# EasyEDA Pro project MSDRV5.eprj

# Schematic Schematic2
Create Date: 2024-12-22; Page Name: P1; Project Name: MSDRV5; Schematic Name: Schematic2; Update Date: 2024-12-21; Company: EasyEDA.com; Page Size: A4; Version: V1.0
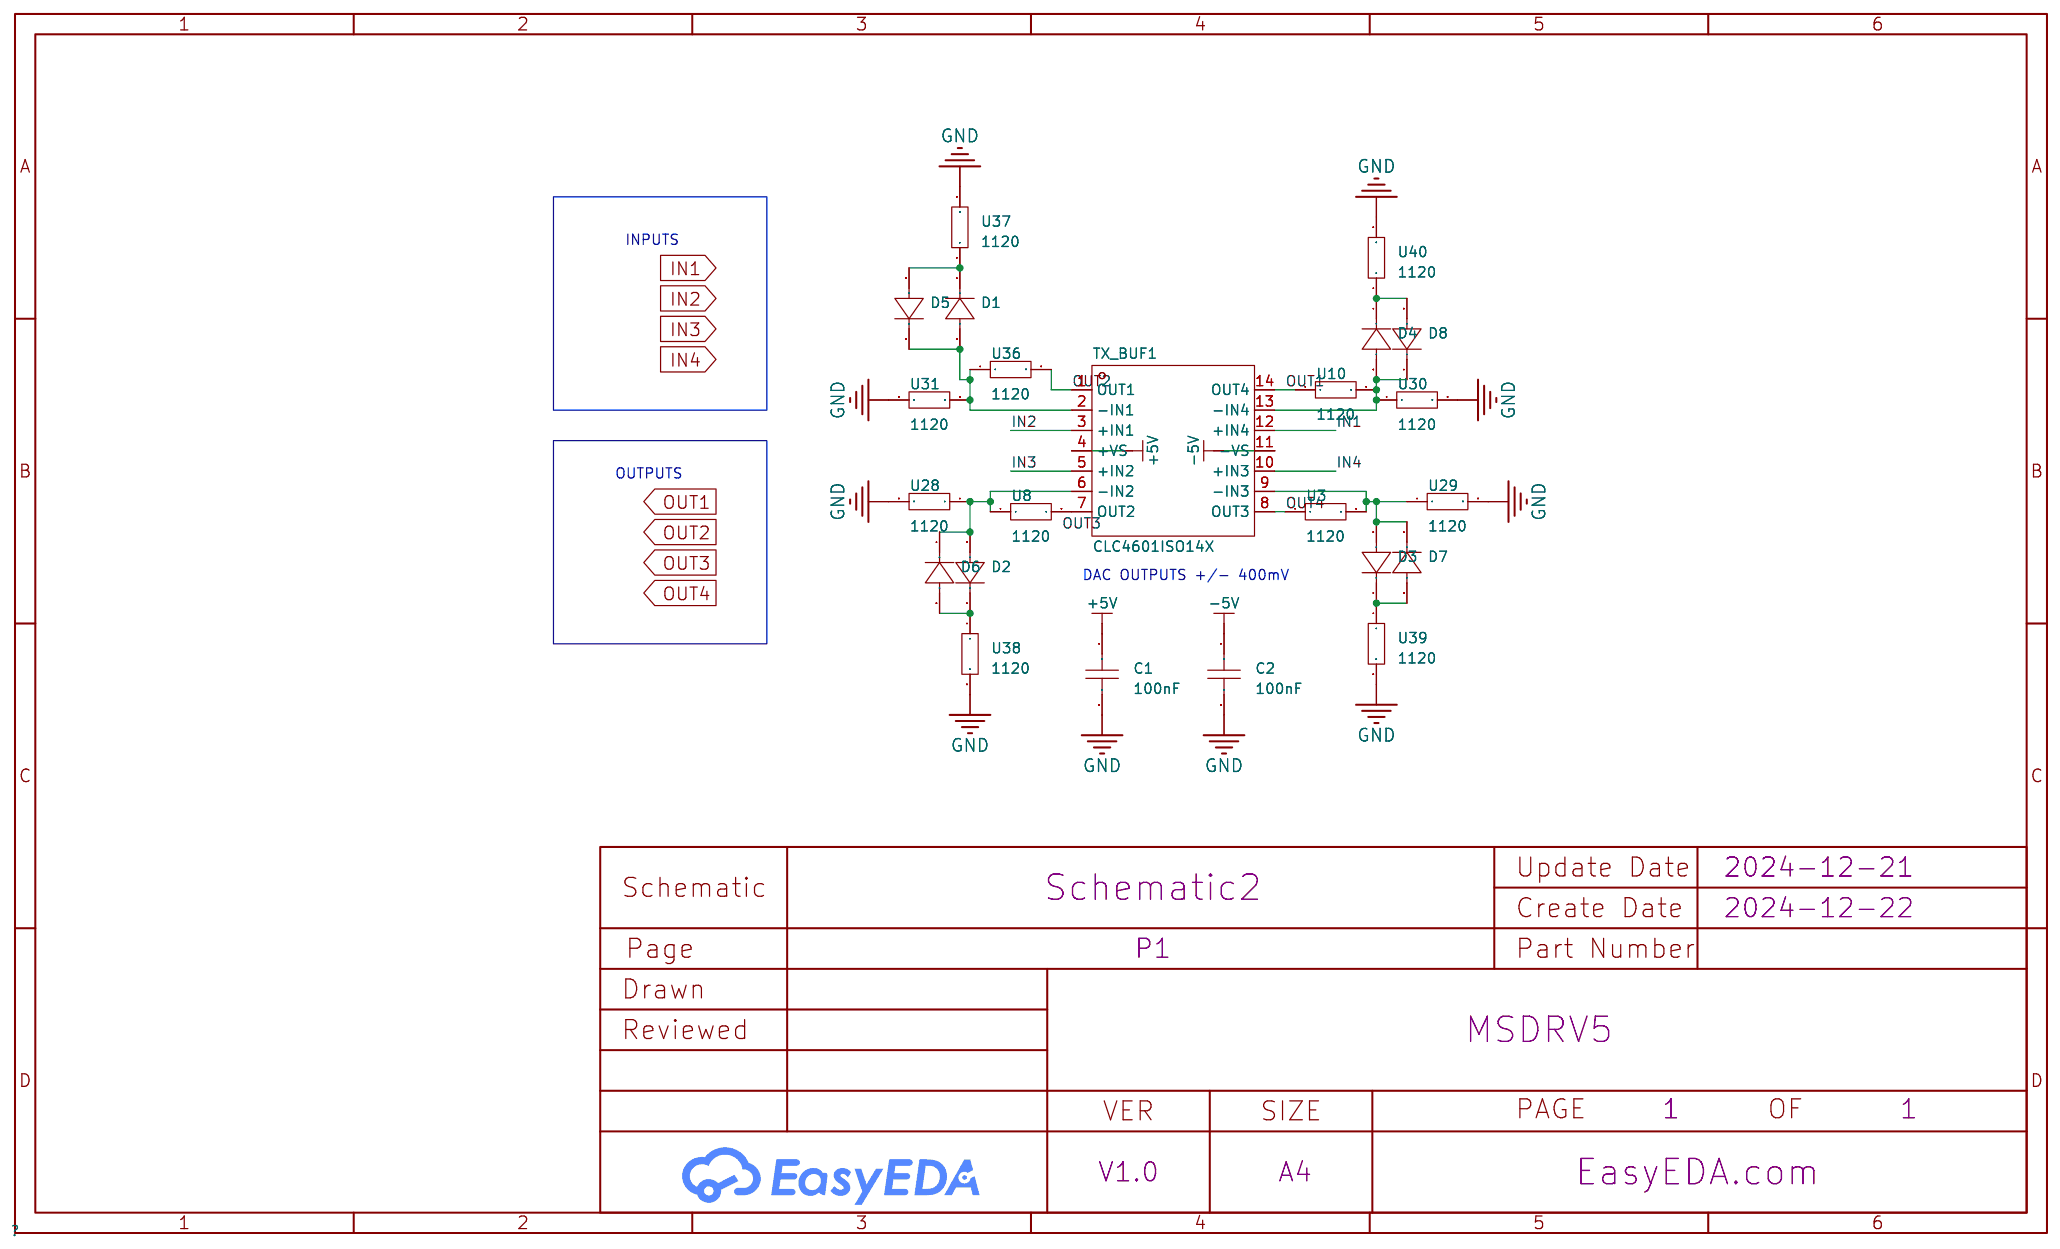
[diagram p0: schematic sheet]

## Parts
C1  100nF  [C0805]
C2  100nF  [C0805]
D1  -  [SMA_L4.4-W2.8-LS5.4-RD]
D2  -  [SMA_L4.4-W2.8-LS5.4-RD]
D3  -  [SMA_L4.4-W2.8-LS5.4-RD]
D4  -  [SMA_L4.4-W2.8-LS5.4-RD]
D5  -  [SMA_L4.4-W2.8-LS5.4-RD]
D6  -  [SMA_L4.4-W2.8-LS5.4-RD]
D7  -  [SMA_L4.4-W2.8-LS5.4-RD]
D8  -  [SMA_L4.4-W2.8-LS5.4-RD]
TX_BUF1  CLC4601ISO14X  [SOIC-14_L8.7-W3.9-P1.27-LS6.0-BL]
U3  1120  [R0805]
U8  1120  [R0805]
U10  1120  [R0805]
U28  1120  [R0805]
U29  1120  [R0805]
U30  1120  [R0805]
U31  1120  [R0805]
U36  1120  [R0805]
U37  1120  [R0805]
U38  1120  [R0805]
U39  1120  [R0805]
U40  1120  [R0805]

## Library data of the parts
C1 C2 = CAP_0805: Supplier Footprint: 0805
D1-D8 = 1N4007: Supplier Footprint: SMA(DO-214AC); Supplier Part: C727081
TX_BUF1 = CLC4601ISO14X: Number of Circuits:; Supplier Part: C49944; Supplier Footprint: SOIC-14; JLCPCB Part Class: Extended Part; Supplier: LCSC
U3 U8 U10 U28-U31 U36-U40 = 3R00: Supplier Part: C9900008006; JLCPCB Part Class: Extended Part; Supplier: LCSC

## Nets
+5V: C1.1 TX_BUF1.4(+VS)
-5V: C2.1 TX_BUF1.11(-VS)
GND: C1.2 C2.2 U28.2 U29.2 U30.2 U31.1 U37.2 U38.2 U39.2 U40.2
IN1: TX_BUF1.12(+IN4)
IN2: TX_BUF1.3(+IN1)
IN3: TX_BUF1.5(+IN2)
IN4: TX_BUF1.10(+IN3)
OUT1: TX_BUF1.14(OUT4) U10.1
OUT2: TX_BUF1.1(OUT1) U36.2
OUT3: TX_BUF1.7(OUT2) U8.2
OUT4: TX_BUF1.8(OUT3) U3.1
$1N800: D1.1(K) D5.2(A) U37.1
$1N805: D1.2(A) D5.1(K) TX_BUF1.2(-IN1) U31.2 U36.1
$1N838: D2.2(A) D6.1(K) TX_BUF1.6(-IN2) U8.1 U28.1
$1N849: D2.1(K) D6.2(A) U38.1
$1N878: D3.1(K) D7.2(A) U39.1
$1N883: D3.2(A) D7.1(K) TX_BUF1.9(-IN3) U3.2 U29.1
$1N916: D4.2(A) D8.1(K) TX_BUF1.13(-IN4) U10.2 U30.1
$1N935: D4.1(K) D8.2(A) U40.1

## Notes on the sheet
- INPUTS
- OUTPUTS
- DAC OUTPUTS +/- 400mV

# Schematic Schematic3
Create Date: 2024-12-22; Page Name: P1; Project Name: MSDRV5; Schematic Name: Schematic3; Update Date: 2024-12-21; Company: EasyEDA.com; Page Size: A4; Version: V1.0
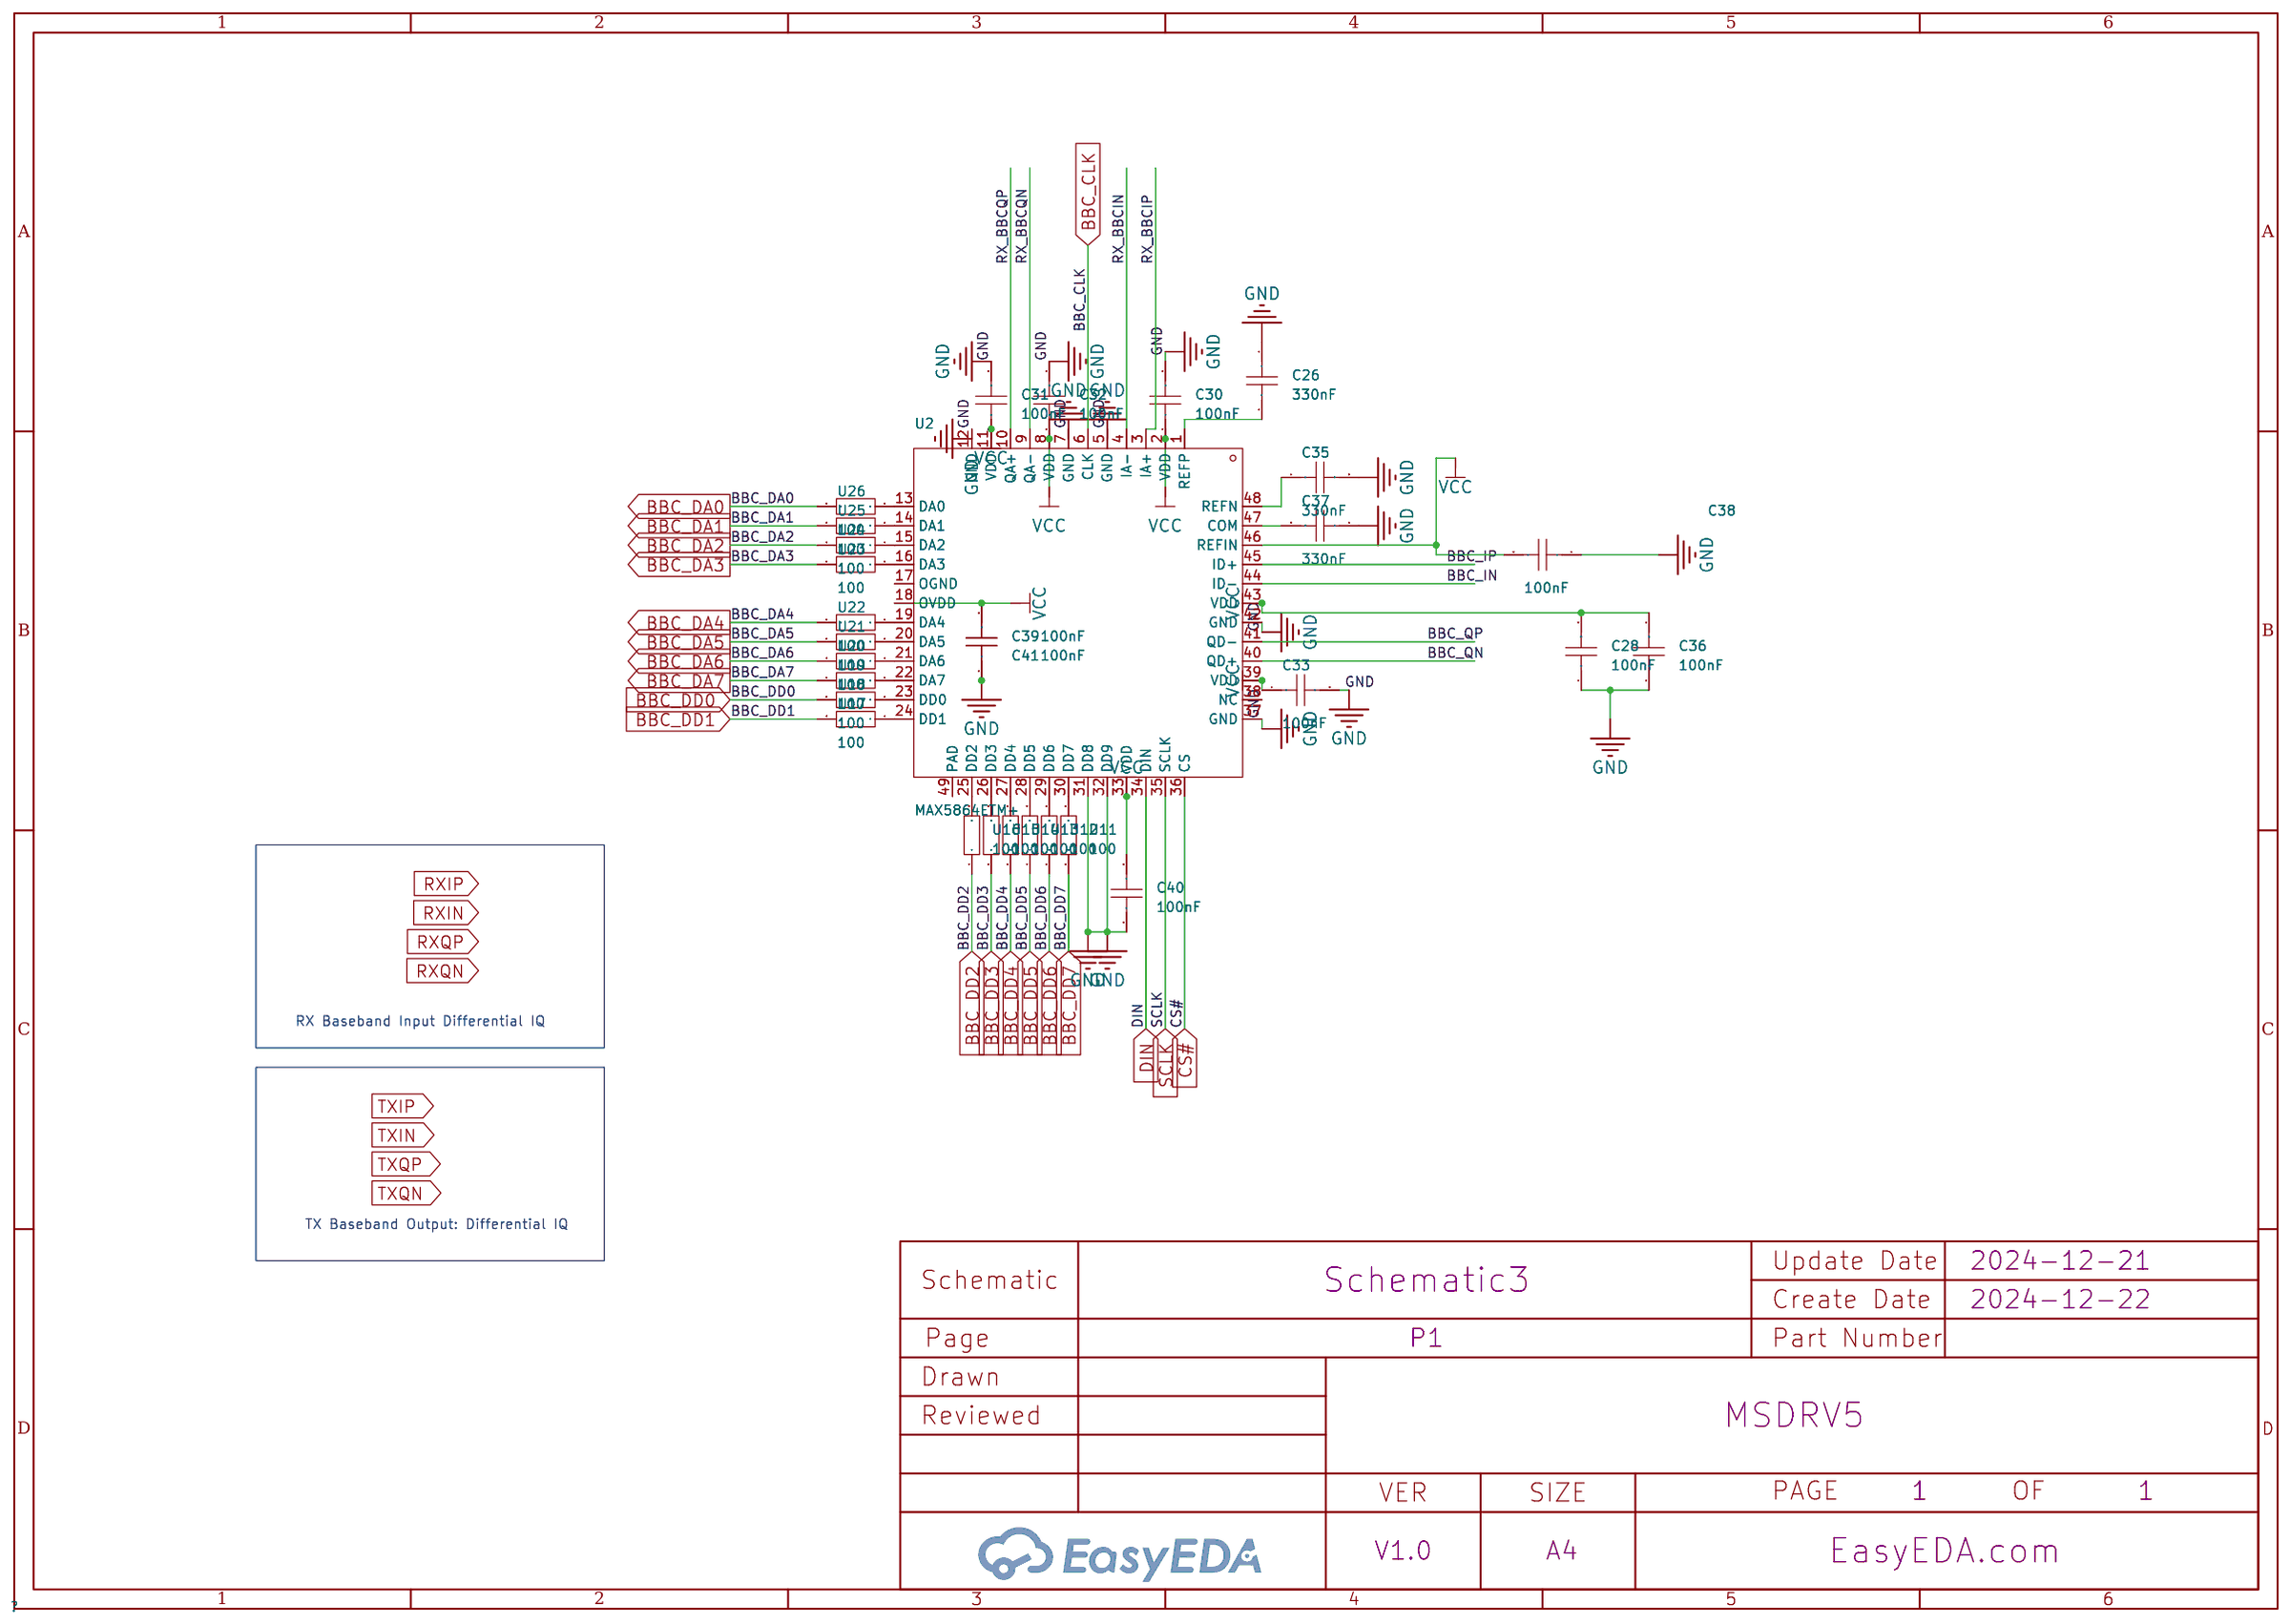
[diagram p1: schematic sheet]

## Parts
C26  330nF  [C0805]
C28  100nF  [C0805]
C30  100nF  [C0805]
C31  100nF  [C0805]
C32  100nF  [C0805]
C33  100nF  [C0805]
C35  330nF  [C0805]
C36  100nF  [C0805]
C37  330nF  [C0805]
C38  100nF  [C0805]
C39  100nF  [C0805]
C40  100nF  [C0805]
C41  100nF  [C0805]
U2  MAX5864ETM+  [QFN-48_L7.0-W7.0-P0.50-BL-EP5.1]
U11  100  [R0805]
U12  100  [R0805]
U13  100  [R0805]
U14  100  [R0805]
U15  100  [R0805]
U16  100  [R0805]
U17  100  [R0805]
U18  100  [R0805]
U19  100  [R0805]
U20  100  [R0805]
U21  100  [R0805]
U22  100  [R0805]
U23  100  [R0805]
U24  100  [R0805]
U25  100  [R0805]
U26  100  [R0805]

## Library data of the parts
C26 C28 C30-C33 C35-C41 = CAP_0805: Supplier Footprint: 0805
U2 = MAX5864ETM+: Supply Voltage:2.7V~3.3V Supply Voltage:2.7V~3.3V; LCSC Part Name: MAX5864ETM; Supplier Part: C143525; Manufacturer: ADI(亚德诺)/MAXIM(美信); Supplier Footprint: QFN-48-EP(7x7); JLCPCB Part Class: Extended Part; Datasheet: https://atta.szlcsc.com/upload/public/pdf/source/20171204/C143525_15123772477351162683.pdf; Supplier: LCSC; Supply Voltage: 2.7V~3.3V
U11-U26 = 3R00: Supplier Part: C9900008006; JLCPCB Part Class: Extended Part; Supplier: LCSC

## Nets
GND: C26.1 C28.1 C30.2 C31.1 C32.1 C33.2 C35.2 C36.1 C37.1 C38.1 C39.1 C40.1 C41.1 U2.5(GND) U2.7(GND) U2.12(GND) U2.31(DD8) U2.32(DD9) U2.37(GND) U2.42(GND)
VCC: C28.2 C30.1 C31.2 C32.2 C33.1 C36.2 C38.2 C39.2 C40.2 C41.2 U2.2(VDD) U2.8(VDD) U2.11(VDD) U2.18(OVDD) U2.33(VDD) U2.39(VDD) U2.43(VDD) U2.46(REFIN)
BBC_CLK: U2.6(CLK)
BBC_DA0: U26.2
BBC_DA1: U25.2
BBC_DA2: U24.2
BBC_DA3: U23.2
BBC_DA4: U22.2
BBC_DA5: U21.2
BBC_DA6: U20.2
BBC_DA7: U19.2
BBC_DD0: U18.2
BBC_DD1: U17.2
BBC_DD2: U16.1
BBC_DD3: U15.1
BBC_DD4: U14.1
BBC_DD5: U13.1
BBC_DD6: U12.1
BBC_DD7: U11.1
BBC_IN: U2.44(ID-)
BBC_IP: U2.45(ID+)
BBC_QN: U2.40(QD+)
BBC_QP: U2.41(QD-)
CS#: U2.36(CS)
DIN: U2.34(DIN)
RX_BBCIN: U2.4(IA-)
RX_BBCIP: U2.3(IA+)
RX_BBCQN: U2.9(QA-)
RX_BBCQP: U2.10(QA+)
SCLK: U2.35(SCLK)
$1N1453: C37.2 U2.47(COM)
$1N1456: U2.30(DD7) U11.2
$1N1459: U2.29(DD6) U12.2
$1N1462: U2.28(DD5) U13.2
$1N1465: U2.27(DD4) U14.2
$1N1468: U2.26(DD3) U15.2
$1N1471: U2.25(DD2) U16.2
$1N1476: U2.24(DD1) U17.1
$1N1479: U2.23(DD0) U18.1
$1N1484: U2.21(DA6) U20.1
$1N1487: U2.20(DA5) U21.1
$1N1490: U2.19(DA4) U22.1
$1N1493: U2.16(DA3) U23.1
$1N1496: U2.15(DA2) U24.1
$1N1499: U2.14(DA1) U25.1
$1N1502: U2.13(DA0) U26.1
$1N1504: C35.1 U2.48(REFN)
$1N1505: C26.2 U2.1(REFP)
$1N1514: U2.22(DA7) U19.1

Not connected (* = marked no-connect by the designer): U2 17(OGND) 38(NC) 49(PAD)

## Notes on the sheet
- RX Baseband Input Differential IQ
- TX Baseband Output: Differential IQ

# Schematic Schematic3_1
Create Date: 2024-12-22; Page Name: P1; Project Name: MSDRV5; Schematic Name: Schematic3_1; Update Date: 2024-12-21; Company: EasyEDA.com; Drawn: EasyEDA; Page Size: A4; Part Number: JLCPCB-002; Reviewed: EasyEDA; Version: V0.1
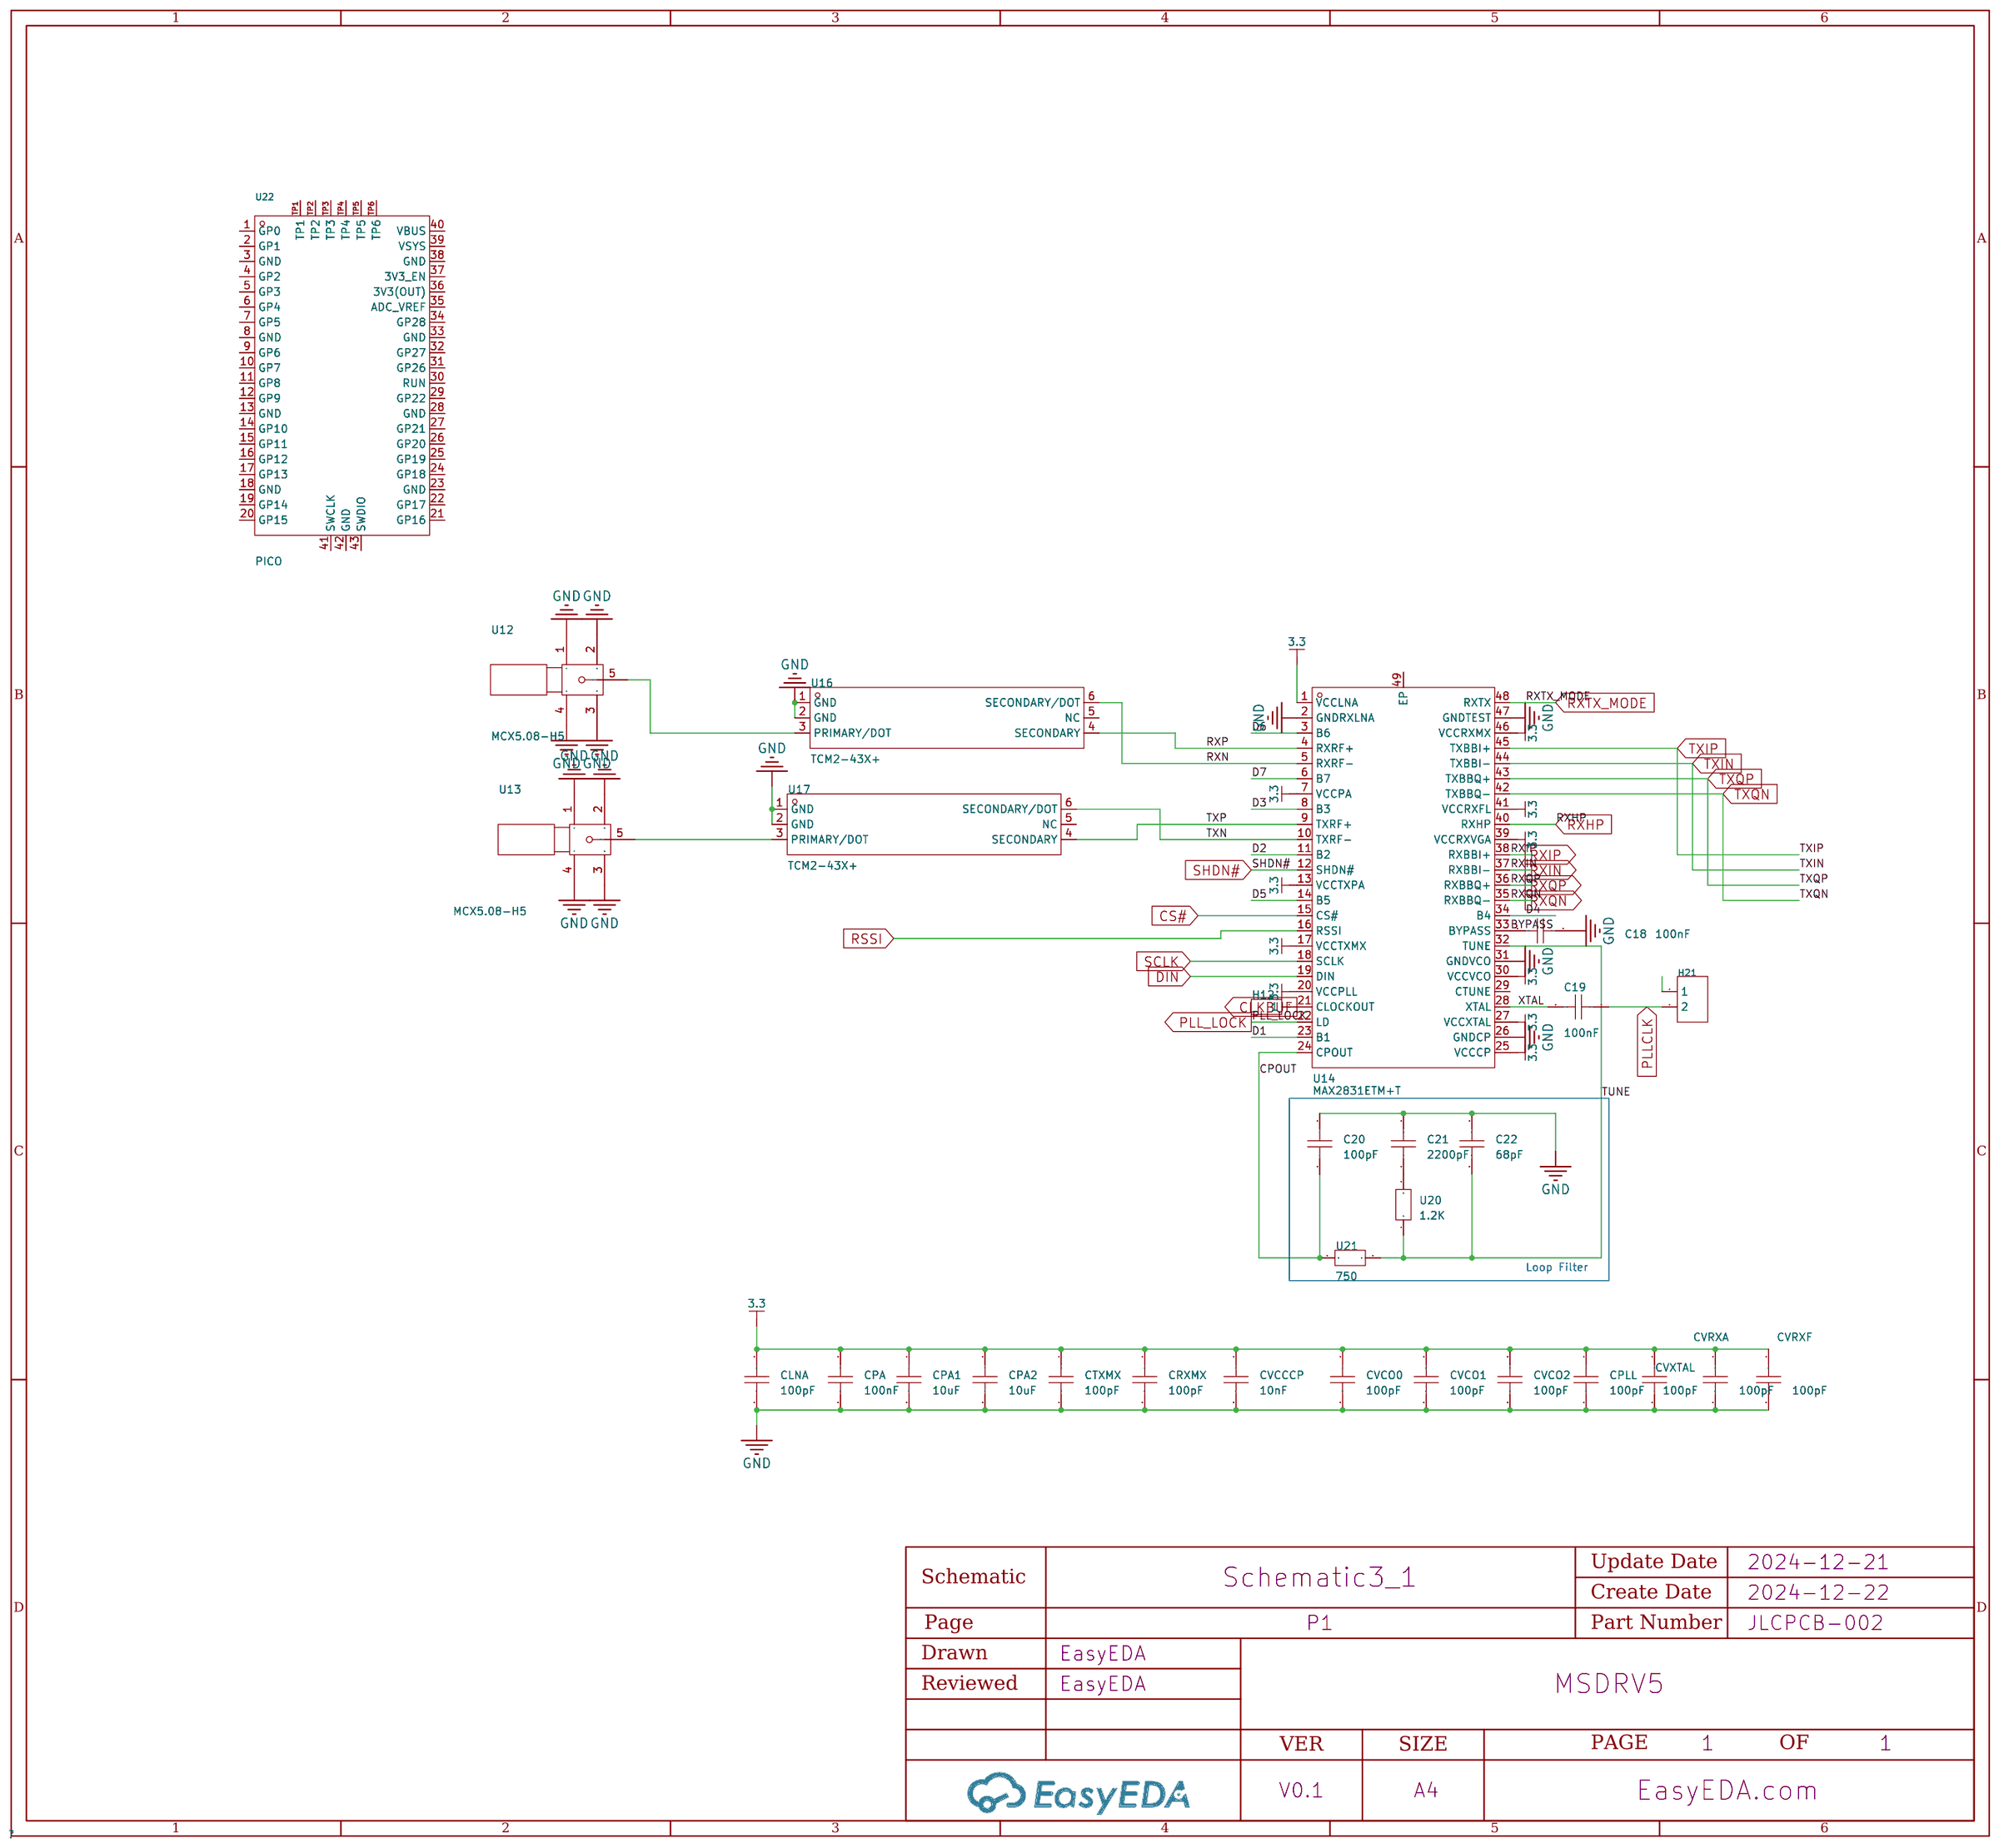
[diagram p2: schematic sheet]

## Parts
C18  100nF  [C0805]
C19  100nF  [C0805]
C20  100pF  [C0805]
C21  2200pF  [C0805]
C22  68pF  [C0805]
CBB1  -
CLNA  100pF  [C0805]
CPA  100nF  [C0805]
CPA1  10uF  [C0805]
CPA2  10uF  [C0805]
CPLL  100pF  [C0805]
CRXMX  100pF  [C0805]
CTXMX  100pF  [C0805]
CVCCCP  10nF  [C0805]
CVCO0  100pF  [C0805]
CVCO1  100pF  [C0805]
CVCO2  100pF  [C0805]
CVRXA  100pF  [C0805]
CVRXF  100pF  [C0805]
CVXTAL  100pF  [C0805]
H12  -  [HDR-TH_1P-V-M_XKB_X4611WV-01I-C28D40]
H21  -  [HDR-TH_2P-P2.54-V-F]
U12  MCX5.08-H5  [SMA-TH_MCX5.08-H5]
U13  MCX5.08-H5  [SMA-TH_MCX5.08-H5]
U14  MAX2831ETM+T  [TQFN-48_L7.0-W7.0-P0.50-TL-EP5.6]
U16  TCM2-43X+  [IND-SMD_6P-L4.1-W3.8-P1.27-TL]
U17  TCM2-43X+  [IND-SMD_6P-L4.1-W3.8-P1.27-TL]
U20  1.2K  [R0805]
U21  750  [R0805]
U22  PICO  [COMM-SMD_L51.0-W21.0-P2.54_SC0916]

## Library data of the parts
C18-C22 CLNA CPA CPA1 CPA2 CPLL CRXMX CTXMX CVCCCP CVCO0-CVCO2 CVRXA CVRXF CVXTAL = CAP_0603: Supplier Footprint: 0603
H12 = HDR-M_2.54_1x1P: Supplier Footprint: Through
H21 = HDR-F_2.54_1x2P: Supplier Footprint: Through
U12 U13 = MCX5.08-H5_C9900009324: Supplier Part: C9900009324; Supplier Footprint: COAX-F; JLCPCB Part Class: Extended Part; Supplier: LCSC
U14 = MAX2831ETM+T: Frequency Range:2.4GHz Frequency Range:2.4GHz Interface:SPI Operating Voltage:2.7V~3.6V Operating Voltage:2.7V~3.6V Applications:WiFi Output Power:21dBm Data Rate:54Mbps Current Of Transmitting:82mA Sensitivity:-76dBm Receive Current:62mA Operating Temper; Supplier Part: C2152047; Manufacturer: ADI(亚德诺)/MAXIM(美信); Supplier Footprint: TQFN-48-EP(7x7); JLCPCB Part Class: Extended Part; Datasheet: https://atta.szlcsc.com/upload/public/pdf/source/20210601/D5E13A4F591163B65DE03F91E5182685.pdf; Supplier: LCSC; Frequency Range: 2.4GHz; Interface: SPI; Operating Voltage: 2.7V~3.6V; Applications: WiFi; Output Power: 21dBm; Data Rate: 54Mbps; Current Of Transmitting: 82mA; Sensitivity: -76dBm; Receive Current: 62mA; Operating Temperature: -40℃~+85℃
U16 U17 = TCM2-43X+: Frequency Range:10MHz~4GHz Frequency Range:10MHz~4GHz Impedance Ratio-Unbalanced/Balanced:1:2 Insertion Loss (Max):3dB Phase Balance:7° Return Loss (Min):14.98dB; LCSC Part Name: 射频变压器; Supplier Part: C2885644; Manufacturer: Mini-Circuits; Supplier Footprint: SMD-6P; JLCPCB Part Class: Extended Part; Datasheet: https://atta.szlcsc.com/upload/public/pdf/source/20210825/C2885644_24D8D5254C12C7AF6CFE8387515C0B6D.pdf; Supplier: LCSC; Frequency Range: 10MHz~4GHz; Impedance Ratio-Unbalanced/Balanced: 1:2; Insertion Loss (Max): 3dB; Phase Balance: 7°; Return Loss (Min): 14.98dB
U20 U21 = SCR0805J1M: Type:Thick Film Resistors Resistance:1MΩ Tolerance:±5% Tolerance:±5% Power(Watts): Overload Voltage (Max): Operating Temperature Range:-55℃~+155℃ Operating Temperature Range:-55℃~+155℃; LCSC Part Name: 1MΩ ±5%; Supplier Part: C5140152; Manufacturer: VO(翔胜); Supplier Footprint: 0805; JLCPCB Part Class: Extended Part; Datasheet: https://atta.szlcsc.com/upload/public/pdf/source/20220823/E5DDB4243192CD3C8AE9677163F934FF.pdf; Supplier: LCSC; Type: Thick Film Resistors; Tolerance: ±5%; Operating Temperature Range: -55℃~+155℃
U22 = PICO: Supplier Part: C7203002; Manufacturer: Raspberry Pi(树莓派); JLCPCB Part Class: Extended Part; Datasheet: https://atta.szlcsc.com/upload/public/pdf/source/20230906/086376002DDC9866828648BC93E51F8B.pdf; Supplier: LCSC

## Nets
GND: C18.1 C20.1 C21.1 C22.1 CLNA.2 CPA.2 CPA1.2 CPA2.2 CPLL.2 CRXMX.2 CTXMX.2 CVCCCP.2 CVCO0.2 CVCO1.2 CVCO2.2 CVRXA.2 CVRXF.2 CVXTAL.2 U12.1 U12.2 U12.3 U12.4 U13.1 U13.2 U13.3 U13.4 U14.2(GNDRXLNA) U14.26(GNDCP) U14.31(GNDVCO) U14.47(GNDTEST) U16.1(GND) U16.2(GND) U17.1(GND) U17.2(GND)
3.3: CLNA.1 CPA.1 CPA1.1 CPA2.1 CPLL.1 CRXMX.1 CTXMX.1 CVCCCP.1 CVCO0.1 CVCO1.1 CVCO2.1 CVRXA.1 CVRXF.1 CVXTAL.1 U14.1(VCCLNA) U14.7(VCCPA) U14.13(VCCTXPA) U14.17(VCCTXMX) U14.20(VCCPLL) U14.25(VCCCP) U14.27(VCCXTAL) U14.30(VCCVCO) U14.39(VCCRXVGA) U14.41(VCCRXFL) U14.46(VCCRXMX)
BYPASS: C18.2 U14.33(BYPASS)
CLKBUF: H12.1 U14.21(CLOCKOUT)
CPOUT: C20.2 U14.24(CPOUT) U21.2
CS#: U14.15(CS#)
D1: U14.23(B1)
D2: U14.11(B2)
D3: U14.8(B3)
D4: U14.34(B4)
D5: U14.14(B5)
D6: U14.3(B6)
D7: U14.6(B7)
DIN: U14.19(DIN)
PLL_LOCK: U14.22(LD)
PLLCLK: C19.1 H21.2
RSSI: U14.16(RSSI)
RXHP: U14.40(RXHP)
RXIN: U14.37(RXBBI-)
RXIP: U14.38(RXBBI+)
RXN: U14.5(RXRF-) U16.6(SECONDARY/DOT)
RXP: U14.4(RXRF+) U16.4(SECONDARY)
RXQN: U14.35(RXBBQ-)
RXQP: U14.36(RXBBQ+)
RXTX_MODE: U14.48(RXTX)
SCLK: U14.18(SCLK)
SHDN#: U14.12(SHDN#)
TUNE: C22.2 U14.32(TUNE) U20.1 U21.1
TXIN: U14.44(TXBBI-)
TXIP: U14.45(TXBBI+)
TXN: U14.10(TXRF-) U17.6(SECONDARY/DOT)
TXP: U14.9(TXRF+) U17.4(SECONDARY)
TXQN: U14.42(TXBBQ-)
TXQP: U14.43(TXBBQ+)
XTAL: C19.2 U14.28(XTAL)
$1N13355: U12.5 U16.3(PRIMARY/DOT)
$1N20170: U13.5 U17.3(PRIMARY/DOT)
$1N20400: C21.2 U20.2

Not connected (* = marked no-connect by the designer): CBB1 (BBC_CLK); H21 1; U14 29(CTUNE) 49(EP); U16 5(NC); U17 5(NC); U22 1(GP0) 2(GP1) 3(GND) 4(GP2) 5(GP3) 6(GP4) 7(GP5) 8(GND) 9(GP6) 10(GP7) 11(GP8) 12(GP9) 13(GND) 14(GP10) 15(GP11) 16(GP12) 17(GP13) 18(GND) 19(GP14) 20(GP15) 21(GP16) 22(GP17) 23(GND) 24(GP18) 25(GP19) 26(GP20) 27(GP21) 28(GND) 29(GP22) 30(RUN) 31(GP26) 32(GP27) 33(GND) 34(GP28) 35(ADC_VREF) 36(3V3(OUT)) 37(3V3_EN) 38(GND) 39(VSYS) 40(VBUS) 41(SWCLK) 42(GND) 43(SWDIO) TP1 TP2 TP3 TP4 TP5 TP6

## Notes on the sheet
- Loop Filter

# Board PCB2
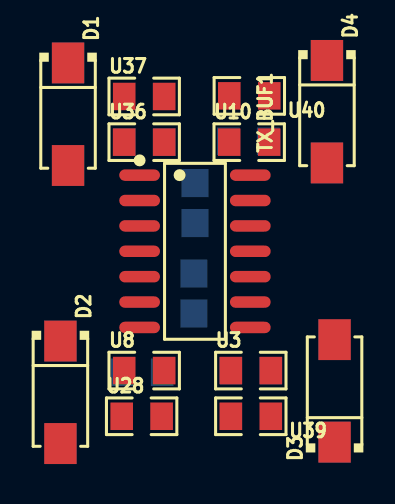
[diagram p3: board, top side]
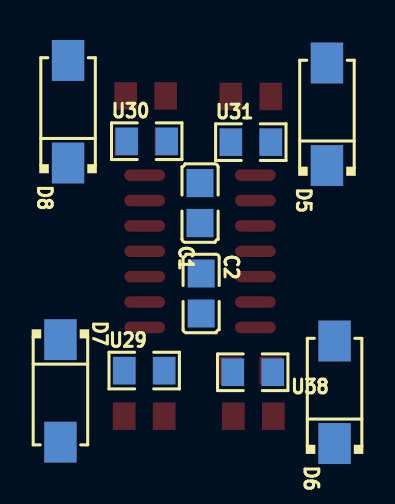
[diagram p4: board, bottom side, seen from below]

No outline. copper layers: Top Layer, Bottom Layer. Coordinates in mm from the lowest, leftmost part position.
Stack: Top Layer 0.035mm / Dielectric1 1.51mm FR4 er 4.5 / Bottom Layer 0.035mm

## Design rules (mm)
template: JLCPCB Capability(Two Layers Board)
spacing copperThickness1oz (default): track to track 0.102, other pairs 0.152 to 0.3
spacing copperThickness2oz: track to track 0.203, other pairs 0.152 to 0.3
track width copperThickness1oz (default): min 0.127, default 0.254, max 2.54
track width copperThickness2oz: min 0.203, default 0.254, max 2.54
differential pair differentialPair (default): width min 0.127, default 0.254, max 2.54; gap min 0.152, default 0.152
via viaSize (default): diameter min 0.5, default 0.61, max 10; hole min 0.3, default 0.305, max 6.3

## Placement (name value [footprint] x y rotation side)
C1  100nF  [C0805]  6.73 10.67 90 bottom
C2  100nF  [C0805]  6.68 6.14 270 bottom
D1  -  [SMA_L4.4-W2.8-LS5.4-RD]  0.38 15.11 270 top
D2  -  [SMA_L4.4-W2.8-LS5.4-RD]  0 1.2 270 top
D3  -  [SMA_L4.4-W2.8-LS5.4-RD]  13.72 1.27 90 top
D4  -  [SMA_L4.4-W2.8-LS5.4-RD]  13.34 15.24 270 top
D5  -  [SMA_L4.4-W2.8-LS5.4-RD]  0.38 15.11 90 bottom
D6  -  [SMA_L4.4-W2.8-LS5.4-RD]  0 1.2 90 bottom
D7  -  [SMA_L4.4-W2.8-LS5.4-RD]  13.72 1.27 270 bottom
D8  -  [SMA_L4.4-W2.8-LS5.4-RD]  13.34 15.24 90 bottom
TX_BUF1  CLC4601ISO14X  [SOIC-14_L8.7-W3.9-P1.27-LS6.0-BL]  6.73 8.25 270 top
U3  1120  [R0805]  9.53 2.29 0 top
U8  1120  [R0805]  4.19 2.29 0 top
U10  1120  [R0805]  9.45 13.72 0 top
U28  1120  [R0805]  4.06 0 0 top
U29  1120  [R0805]  9.53 2.29 180 bottom
U30  1120  [R0805]  9.4 13.76 180 bottom
U31  1120  [R0805]  4.19 13.72 180 bottom
U36  1120  [R0805]  4.19 13.72 0 top
U37  1120  [R0805]  4.19 16 0 top
U38  1120  [R0805]  4.09 2.2 0 bottom
U39  1120  [R0805]  9.53 0 180 top
U40  1120  [R0805]  9.45 16.03 180 top

## Footprints (pads in the part's own frame, mm; a bottom-side part is the same pattern mirrored in y, then rotated)
C0805
  rect 1.41x1.35 smd: 1(-1,0) 2(1,0)
R0805
  rect 1.133x1.377 smd: 1(-1,0) 2(1,0)
SMA_L4.4-W2.8-LS5.4-RD
  rect 2.046x1.62 smd: 1(-2.566,0) 2(2.566,0)
SOIC-14_L8.7-W3.9-P1.27-LS6.0-BL
  oval 0.574x2.038 smd: 1(-3.81,-2.769) 2(-2.54,-2.769) 3(-1.27,-2.769) 4(0,-2.769) 5(1.27,-2.769) 6(2.54,-2.769) 7(3.81,-2.769) 8(3.81,2.769) 9(2.54,2.769) 10(1.27,2.769) 11(0,2.769) 12(-1.27,2.769) 13(-2.54,2.769) 14(-3.81,2.769)

## Nets
As in the schematic.

# Board PCB3
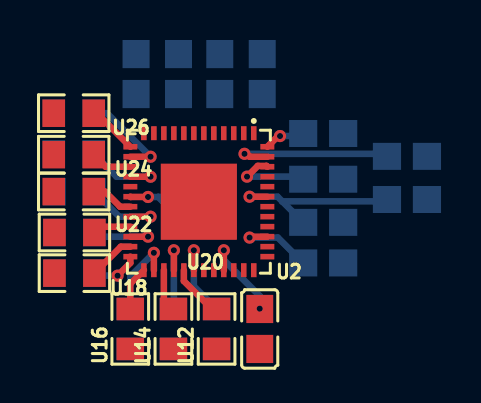
[diagram p5: board, top side]
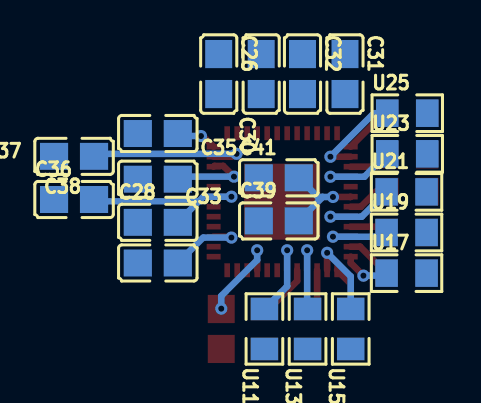
[diagram p6: board, bottom side, seen from below]

No outline. copper layers: Top Layer, Bottom Layer. Coordinates in mm from the lowest, leftmost part position.
Stack: Top Layer 0.035mm / Dielectric1 1.51mm FR4 er 4.5 / Bottom Layer 0.035mm

## Design rules (mm)
template: JLCPCB Capability(Two Layers Board)
spacing copperThickness1oz (default): track to track 0.102, other pairs 0.152 to 0.3
spacing copperThickness2oz: track to track 0.203, other pairs 0.152 to 0.3
track width copperThickness1oz (default): min 0.127, default 0.254, max 2.54
track width copperThickness2oz: min 0.203, default 0.254, max 2.54
differential pair differentialPair (default): width min 0.127, default 0.254, max 2.54; gap min 0.152, default 0.152
via viaSize (default): diameter min 0.5, default 0.61, max 10; hole min 0.3, default 0.305, max 6.3

## Placement (name value [footprint] x y rotation side)
C26  330nF  [C0805]  9.43 12.75 270 bottom
C28  100nF  [C0805]  12.48 5.33 180 bottom
C30  100nF  [C0805]  7.31 12.75 90 bottom
C31  100nF  [C0805]  3.12 12.75 270 bottom
C32  100nF  [C0805]  5.24 12.75 270 bottom
C33  100nF  [C0805]  12.48 3.3 0 bottom
C35  330nF  [C0805]  12.48 9.78 0 bottom
C36  100nF  [C0805]  16.67 6.48 180 bottom
C37  330nF  [C0805]  16.67 8.64 180 bottom
C38  100nF  [C0805]  12.48 7.49 180 bottom
C39  100nF  [C0805]  6.43 5.4 180 bottom
C40  100nF  [C0805]  9.31 0 90 top
C41  100nF  [C0805]  6.43 7.56 180 bottom
U2  MAX5864ETM+  [QFN-48_L7.0-W7.0-P0.50-BL-EP5.1]  6.26 6.37 180 top
U11  100  [R0805]  7.15 0 90 bottom
U12  100  [R0805]  7.15 0 90 top
U13  100  [R0805]  4.99 0 90 bottom
U14  100  [R0805]  4.99 0 90 top
U15  100  [R0805]  2.83 0 90 bottom
U16  100  [R0805]  2.83 0 90 top
U17  100  [R0805]  0.04 2.79 180 bottom
U18  100  [R0805]  0.04 2.79 180 top
U19  100  [R0805]  0.04 4.83 180 bottom
U20  100  [R0805]  0.04 4.83 180 top
U21  100  [R0805]  0.04 6.86 180 bottom
U22  100  [R0805]  0 6.88 180 top
U23  100  [R0805]  0 8.76 180 bottom
U24  100  [R0805]  0 8.72 180 top
U25  100  [R0805]  0 10.79 180 bottom
U26  100  [R0805]  0 10.79 180 top

## Footprints (pads in the part's own frame, mm; a bottom-side part is the same pattern mirrored in y, then rotated)
C0805
  rect 1.41x1.35 smd: 1(-1,0) 2(1,0)
QFN-48_L7.0-W7.0-P0.50-BL-EP5.1
  rect 0.28x0.7 smd: 1(-2.75,-3.428) 2(-2.25,-3.428) 3(-1.75,-3.428) 4(-1.25,-3.428) 5(-0.75,-3.428) 6(-0.25,-3.428) 7(0.25,-3.428) 8(0.75,-3.428) 9(1.25,-3.428) 10(1.75,-3.428) 11(2.25,-3.428) 12(2.75,-3.428) 25(2.75,3.428) 26(2.25,3.428) 27(1.75,3.428) 28(1.25,3.428) 29(0.75,3.428) 30(0.25,3.428) 31(-0.25,3.428) 32(-0.75,3.428) 33(-1.25,3.428) 34(-1.75,3.428) 35(-2.25,3.428) 36(-2.75,3.428)
  rect 0.7x0.28 smd: 13(3.428,-2.75) 14(3.428,-2.25) 15(3.428,-1.75) 16(3.428,-1.25) 17(3.428,-0.75) 18(3.428,-0.25) 19(3.428,0.25) 20(3.428,0.75) 21(3.428,1.25) 22(3.428,1.75) 23(3.428,2.25) 24(3.428,2.75) 37(-3.428,2.75) 38(-3.428,2.25) 39(-3.428,1.75) 40(-3.428,1.25) 41(-3.428,0.75) 42(-3.428,0.25) 43(-3.428,-0.25) 44(-3.428,-0.75) 45(-3.428,-1.25) 46(-3.428,-1.75) 47(-3.428,-2.25) 48(-3.428,-2.75)
  rect 3.81x3.81 smd: 49(0,0)
R0805
  rect 1.133x1.377 smd: 1(-1,0) 2(1,0)

## Nets
As in the schematic.

Pads without a net: U2 17 38 49

## Via types
v1: diameter 0.61, hole 0.305, Top Layer to Bottom Layer, 16 vias

## Routing (per net, layer and track width the routed paths; a pad name or vN(x,y) marks a point on that pad's centre or on a via; arc(x,y) is an arc through that point)
VCC: length 27
  Top Layer w0.33: U2.46 9.64,8.16 9.21,8.16 v1(8.67,7.62) ; U2.39 8.84,4.62 v1(8.8,4.57) ; v1(3.72,6.6) 2.85,6.6 U2.18 ; v1(9.31,1.02) C40.2 ; U2.33 v1(7.51,3.94) ; U2.43 v1(8.8,6.62)
  Bottom Layer w0.33: v1(8.8,4.57) 10.21,4.57 C33.1 ; 4.23,6.6 4.47,6.6 C41.2 ; 4.23,6.6 C39.2 ; 4.23,6.6 v1(3.72,6.6) ; v1(9.31,1.02) 9.31,1.65 7.51,3.45 v1(7.51,3.94) ; 10.43,6.39 C28.2 ; 10.43,6.39 15.58,6.39 C36.2 15.66,6.48 ; 10.43,6.39 10.2,6.62 v1(8.8,6.62) ; C38.2 11.35,7.62 v1(8.67,7.62)
$1N1453: length 8.4
  Top Layer w0.33: U2.47 8.8,8.62 8.65,8.76 v1(8.54,8.76)
  Bottom Layer w0.33: 15.42,8.64 15.42,8.63 15.4,8.62 ; C37.2 15.55,8.76 v1(8.54,8.76)
$1N1456: length 4.4
  Top Layer w0.33: U2.30 v1(6.01,3.94)
  Bottom Layer w0.33: v1(6.01,3.94) 6.01,2.14 U11.2
$1N1459: length 2.8
  Top Layer w0.33: U12.2 6.91,1 5.51,2.4 U2.29
$1N1462: length 3.9
  Top Layer w0.33: U2.28 v1(5.01,3.94)
  Bottom Layer w0.33: v1(5.01,3.94) 5.01,1.02 U13.2
$1N1465: length 2.1
  Top Layer w0.33: U14.2 4.51,1.48 U2.27
$1N1468: length 4.2
  Top Layer w0.33: U2.26 v1(4.01,3.81)
  Bottom Layer w0.33: U15.2 2.83,2.63 v1(4.01,3.81)
$1N1471: length 2.2
  Top Layer w0.33: U16.2 2.83,2.26 U2.25
$1N1476: length 2.4
  Top Layer w0.33: v1(2.19,2.67) 2.83,3.31 U2.24
  Bottom Layer w0.33: v1(2.19,2.67) 1.16,2.67 U17.1
$1N1479: length 2.3
  Top Layer w0.33: U18.1 2.36,4.12 U2.23
$1N1484: length 1.9
  Top Layer w0.33: U20.1 1.33,5.12 U2.21
$1N1487: length 4.3
  Top Layer w0.33: U2.20 v1(3.85,5.62)
  Bottom Layer w0.33: U21.1 2.28,5.62 v1(3.85,5.62)
$1N1490: length 2.1
  Top Layer w0.33: U22.1 1.56,6.88 2.32,6.12 U2.19
$1N1493: length 4.3
  Top Layer w0.33: U2.16 v1(3.85,7.62)
  Bottom Layer w0.33: U23.1 2.15,7.62 v1(3.85,7.62)
$1N1496: length 2.1
  Top Layer w0.33: U2.15 1.6,8.12 U24.1
$1N1499: length 4.8
  Top Layer w0.33: U2.14 v1(3.85,8.62)
  Bottom Layer w0.33: U25.1 1.67,10.79 v1(3.85,8.62)
$1N1502: length 2.5
  Top Layer w0.33: U26.1 1.15,10.79 U2.13
$1N1504: length 2.1
  Top Layer w0.33: v1(10.32,9.65) 10.22,9.65 U2.48
  Bottom Layer w0.33: 11.47,9.78 C35.1 11.35,9.65 v1(10.32,9.65)
$1N1514: length 3.7
  Top Layer w0.33: U2.22 v1(3.72,4.62)
  Bottom Layer w0.33: v1(3.72,4.62) 1.24,4.62 U19.1

# Board PCB3_1
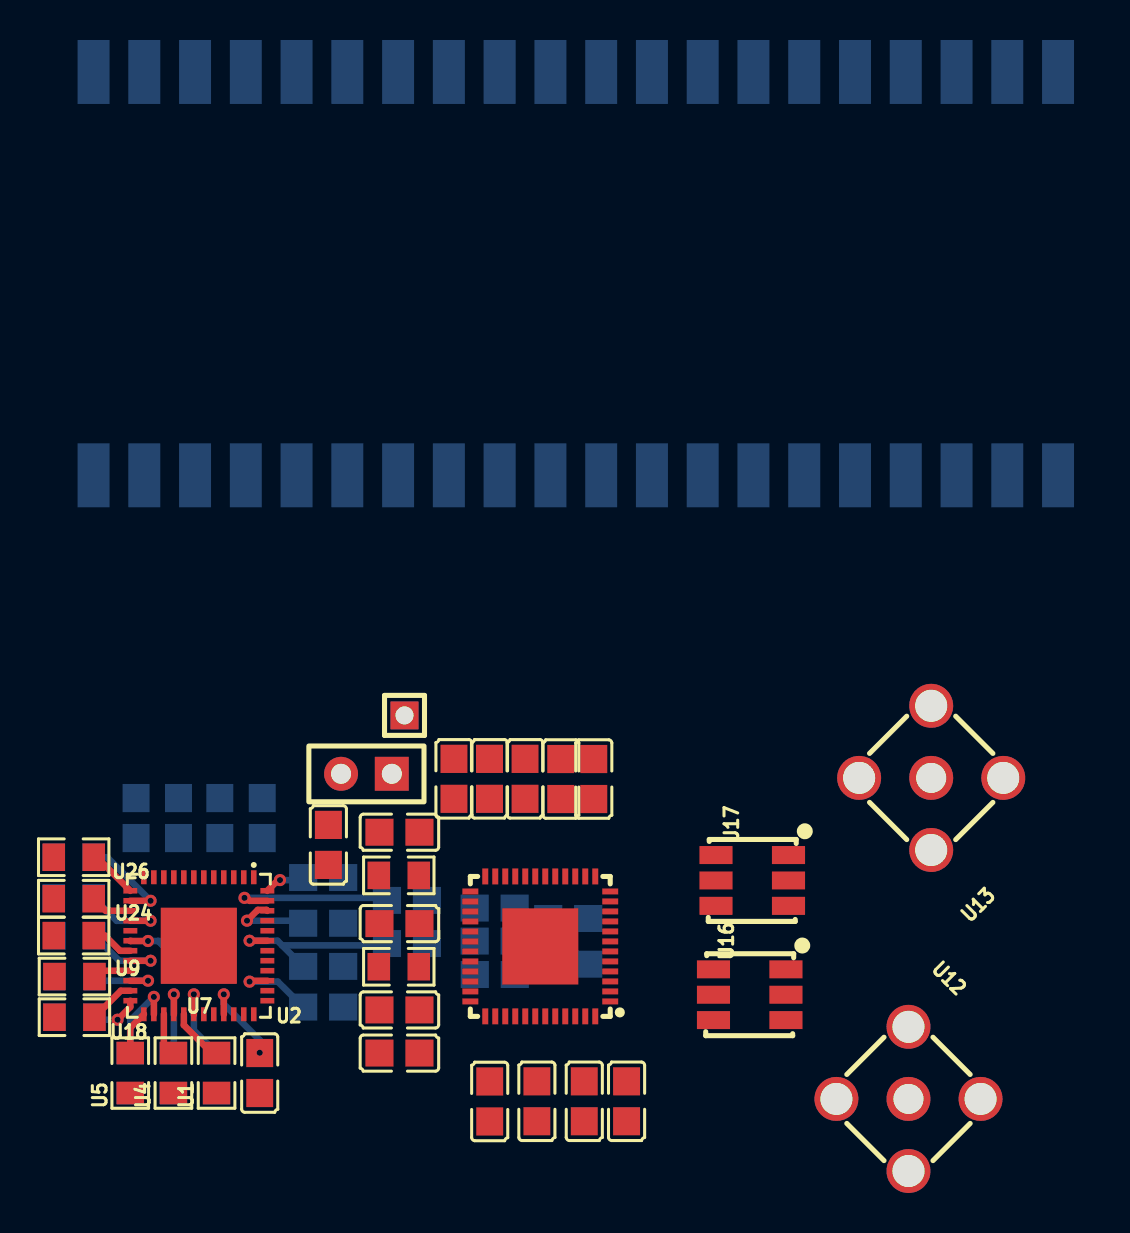
[diagram p7: board, top side]
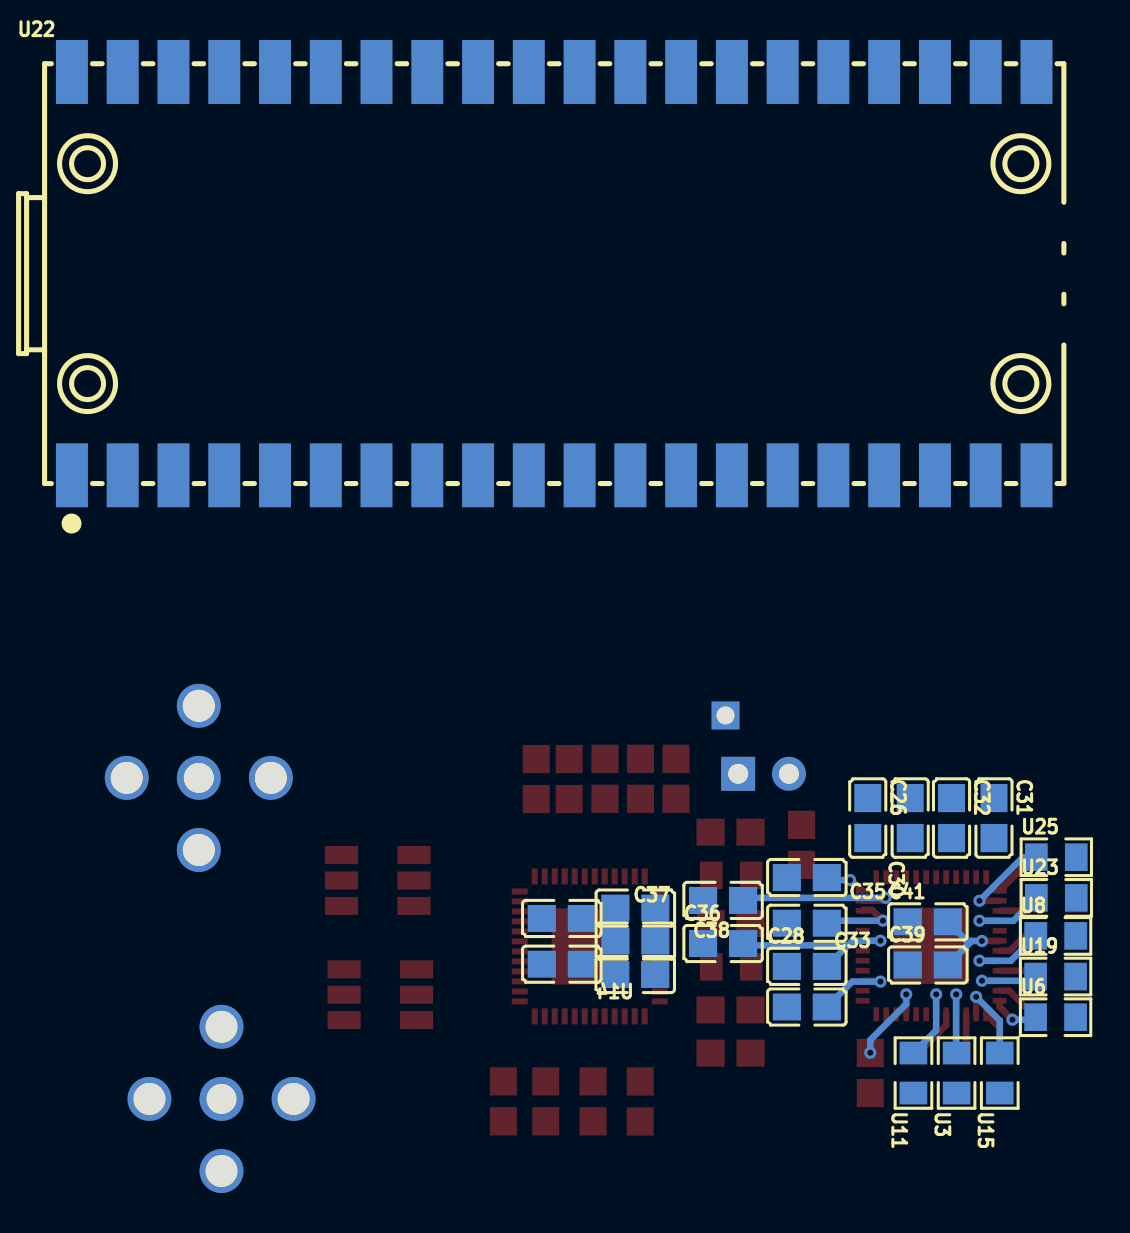
[diagram p8: board, bottom side, seen from below]

No outline. copper layers: Top Layer, GND, Inner1, Inner2, 3.3, Bottom Layer. Coordinates in mm from the lowest, leftmost part position.
Stack: Top Layer 0.035mm 外层铜厚1oz / Dielectric1 0.0994mm 3313 RC57% 4.2mil / GND 0.0152mm 内层铜厚 / Dielectric2 0.55mm 0.55mm H/H不含铜 / Inner1 0.0152mm 内层铜厚 / Dielectric3 0.1088mm 2116 RC54% 4.9mil / Inner2 0.0152mm 内层铜厚 / Dielectric4 0.55mm 0.55mm H/H不含铜 / 3.3 0.0152mm 内层铜厚 / Dielectric5 0.0994mm 3313 RC57% 4.2mil / Bottom Layer 0.035mm 外层铜厚1oz

## Design rules (mm)
net RXQN: RXQ
net RXQP: RXQ
net RXIN: RXI
net RXIP: RXI
net TXQN: TXQ
net TXQP: TXQ
net TXIN: TXI
net TXIP: TXI
net RXP: RX
net RXN: RX
net TXP: TX
net TXN: TX
template: Custom Config
spacing copperThickness1oz (default): track to track 0.102, other pairs 0.152 to 0.3
spacing copperThickness2oz: track to track 0.203, other pairs 0.152 to 0.3
track width copperThickness1oz (default): min 0.127, default 0.254, max 2.54
track width copperThickness2oz: min 0.203, default 0.254, max 2.54
differential pair differentialPair (default): width min 0.127, default 0.254, max 2.54; gap min 0.152, default 0.152
via viaSize (default): diameter min 0.356, default 0.61, max 10; hole min 0.198, default 0.305, max 6.3

## Placement (name value [footprint] x y rotation side)
C18  100nF  [C0805]  16.3 2.42 0 top
C19  100nF  [C0805]  12.74 12.83 270 top
C20  100pF  [C0805]  16.3 13.47 0 top
C21  2200pF  [C0805]  16.3 4.58 180 top
C22  68pF  [C0805]  16.3 8.9 0 top
C26  330nF  [C0805]  9.43 14.18 270 bottom
C28  100nF  [C0805]  12.48 6.76 180 bottom
C30  100nF  [C0805]  7.31 14.18 90 bottom
C31  100nF  [C0805]  3.12 14.18 270 bottom
C32  100nF  [C0805]  5.24 14.18 270 bottom
C33  100nF  [C0805]  12.48 4.72 0 bottom
C35  330nF  [C0805]  12.48 11.2 0 bottom
C36  100nF  [C0805]  16.67 7.9 180 bottom
C37  330nF  [C0805]  16.67 10.06 180 bottom
C38  100nF  [C0805]  12.48 8.91 180 bottom
C39  100nF  [C0805]  6.43 6.83 180 bottom
C40  100nF  [C0805]  9.31 1.42 90 top
C41  100nF  [C0805]  6.43 8.99 180 bottom
CLNA  100pF  [C0805]  27.66 0.01 270 top
CPA  100nF  [C0805]  26.02 16.13 90 top
CPA1  10uF  [C0805]  24.74 9.15 180 bottom
CPA2  10uF  [C0805]  24.74 6.87 180 bottom
CPLL  100pF  [C0805]  22.58 16.14 90 top
CRXMX  100pF  [C0805]  25.55 0.01 270 top
CTXMX  100pF  [C0805]  24.37 16.13 90 top
CVCCCP  10nF  [C0805]  20.8 16.14 90 top
CVCO0  100pF  [C0805]  21.06 9.67 0 bottom
CVCO1  100pF  [C0805]  21.06 8.02 0 bottom
CVCO2  100pF  [C0805]  21.07 6.35 0 bottom
CVRXA  100pF  [C0805]  20.81 0 270 top
CVRXF  100pF  [C0805]  23.18 0.01 270 top
CVXTAL  100pF  [C0805]  19.03 16.14 90 top
H12  -  [HDR-TH_1P-V-M_XKB_X4611WV-01I-C28D40]  16.55 19.31 180 top
H21  -  [HDR-TH_2P-P2.54-V-F]  14.65 16.39 180 top
U1  100  [R0805]  7.15 1.42 90 top
U2  MAX5864ETM+  [QFN-48_L7.0-W7.0-P0.50-BL-EP5.1]  6.26 7.79 180 top
U3  100  [R0805]  4.99 1.42 90 bottom
U4  100  [R0805]  4.99 1.42 90 top
U5  100  [R0805]  2.83 1.42 90 top
U6  100  [R0805]  0.04 4.22 180 bottom
U7  100  [R0805]  0.04 6.25 180 top
U8  100  [R0805]  0.04 8.28 180 bottom
U9  100  [R0805]  0 8.3 180 top
U11  100  [R0805]  7.15 1.42 90 bottom
U12  MCX5.08-H5  [SMA-TH_MCX5.08-H5]  41.77 0.13 315 top
U13  MCX5.08-H5  [SMA-TH_MCX5.08-H5]  42.91 16.19 45 top
U14  MAX2831ETM+T  [TQFN-48_L7.0-W7.0-P0.50-TL-EP5.6]  23.34 7.76 180 top
U15  100  [R0805]  2.83 1.42 90 bottom
U16  TCM2-43X+  [IND-SMD_6P-L4.1-W3.8-P1.27-TL]  33.82 5.34 270 top
U17  TCM2-43X+  [IND-SMD_6P-L4.1-W3.8-P1.27-TL]  33.95 11.06 270 top
U18  100  [R0805]  0.04 4.22 180 top
U19  100  [R0805]  0.04 6.25 180 bottom
U20  1.2K  [R0805]  16.27 6.74 180 top
U21  750  [R0805]  16.27 11.31 0 top
U22  PICO  [COMM-SMD_L51.0-W21.0-P2.54_SC0916]  24.81 41.41 180 bottom
U23  100  [R0805]  0 10.19 180 bottom
U24  100  [R0805]  0 10.14 180 top
U25  100  [R0805]  0 12.22 180 bottom
U26  100  [R0805]  0 12.22 180 top

## Footprints (pads in the part's own frame, mm; a bottom-side part is the same pattern mirrored in y, then rotated)
C0805
  rect 1.41x1.35 smd: 1(-1,0) 2(1,0)
COMM-SMD_L51.0-W21.0-P2.54_SC0916
  rect 1.6x3.2 smd: 1(-24.445,-10.088) 2(-21.905,-10.088) 3(-19.365,-10.088) 4(-16.825,-10.088) 5(-14.285,-10.088) 6(-11.745,-10.088) 7(-9.205,-10.088) 8(-6.665,-10.088) 9(-4.125,-10.088) 10(-1.585,-10.088) 11(0.955,-10.088) 12(3.495,-10.088) 13(6.035,-10.088) 14(8.575,-10.088) 15(11.115,-10.088) 16(13.655,-10.088) 17(16.195,-10.088) 18(18.735,-10.088) 19(21.275,-10.088) 20(23.815,-10.088) 21(23.815,10.088) 22(21.275,10.088) 23(18.735,10.088) 24(16.195,10.088) 25(13.655,10.088) 26(11.115,10.088) 27(8.575,10.088) 28(6.035,10.088) 29(3.495,10.088) 30(0.955,10.088) 31(-1.585,10.088) 32(-4.125,10.088) 33(-6.665,10.088) 34(-9.205,10.088) 35(-11.745,10.088) 36(-14.285,10.088) 37(-16.825,10.088) 38(-19.365,10.088) 39(-21.905,10.088) 40(-24.445,10.088)
HDR-TH_1P-V-M_XKB_X4611WV-01I-C28D40
  rect 1.4x1.4 hole 0.9: 1(0,0)
HDR-TH_2P-P2.54-V-F
  rect 1.7x1.7 hole 1: 1(-1.27,0)
  round 1.7 hole 1: 2(1.27,0)
IND-SMD_6P-L4.1-W3.8-P1.27-TL
  rect 0.9x1.657 smd: 1(-1.27,1.813) 2(0,1.813) 3(1.27,1.813) 4(1.27,-1.813) 5(0,-1.813) 6(-1.27,-1.813)
QFN-48_L7.0-W7.0-P0.50-BL-EP5.1
  rect 0.28x0.7 smd: 1(-2.75,-3.428) 2(-2.25,-3.428) 3(-1.75,-3.428) 4(-1.25,-3.428) 5(-0.75,-3.428) 6(-0.25,-3.428) 7(0.25,-3.428) 8(0.75,-3.428) 9(1.25,-3.428) 10(1.75,-3.428) 11(2.25,-3.428) 12(2.75,-3.428) 25(2.75,3.428) 26(2.25,3.428) 27(1.75,3.428) 28(1.25,3.428) 29(0.75,3.428) 30(0.25,3.428) 31(-0.25,3.428) 32(-0.75,3.428) 33(-1.25,3.428) 34(-1.75,3.428) 35(-2.25,3.428) 36(-2.75,3.428)
  rect 0.7x0.28 smd: 13(3.428,-2.75) 14(3.428,-2.25) 15(3.428,-1.75) 16(3.428,-1.25) 17(3.428,-0.75) 18(3.428,-0.25) 19(3.428,0.25) 20(3.428,0.75) 21(3.428,1.25) 22(3.428,1.75) 23(3.428,2.25) 24(3.428,2.75) 37(-3.428,2.75) 38(-3.428,2.25) 39(-3.428,1.75) 40(-3.428,1.25) 41(-3.428,0.75) 42(-3.428,0.25) 43(-3.428,-0.25) 44(-3.428,-0.75) 45(-3.428,-1.25) 46(-3.428,-1.75) 47(-3.428,-2.25) 48(-3.428,-2.75)
  rect 3.81x3.81 smd: 49(0,0)
R0805
  rect 1.133x1.377 smd: 1(-1,0) 2(1,0)
SMA-TH_MCX5.08-H5
  round 2.2 hole 1.6: 1(-2.55,-2.55) 2(-2.55,2.55) 3(2.55,2.55) 4(2.55,-2.55)
  round 2.2 hole 1.5: 5(0,0)
TQFN-48_L7.0-W7.0-P0.50-TL-EP5.6
  rect 0.8x0.3 smd: 1(-3.5,2.751) 2(-3.5,2.251) 3(-3.5,1.75) 4(-3.5,1.251) 5(-3.5,0.75) 6(-3.5,0.252) 7(-3.5,-0.249) 8(-3.5,-0.75) 9(-3.5,-1.25) 10(-3.5,-1.75) 11(-3.5,-2.249) 12(-3.5,-2.748) 25(3.5,-2.748) 26(3.5,-2.249) 27(3.5,-1.75) 28(3.5,-1.25) 29(3.5,-0.75) 30(3.5,-0.249) 31(3.5,0.252) 32(3.5,0.75) 33(3.5,1.251) 34(3.5,1.75) 35(3.5,2.251) 36(3.5,2.751)
  rect 0.3x0.8 smd: 13(-2.751,-3.5) 14(-2.251,-3.5) 15(-1.75,-3.5) 16(-1.25,-3.5) 17(-0.75,-3.5) 18(-0.251,-3.5) 19(0.249,-3.5) 20(0.75,-3.5) 21(1.25,-3.5) 22(1.75,-3.5) 23(2.251,-3.5) 24(2.751,-3.5) 37(2.751,3.5) 38(2.251,3.5) 39(1.75,3.5) 40(1.25,3.5) 41(0.75,3.5) 42(0.251,3.5) 43(-0.251,3.5) 44(-0.75,3.5) 45(-1.25,3.5) 46(-1.75,3.5) 47(-2.251,3.5) 48(-2.751,3.5)
  rect 3.81x3.81 smd: 49(0,0.001)

## Nets
GND: C18.1 C20.1 C21.1 C22.1 C26.1 C28.1 C30.2 C31.1 C32.1 C33.2 C35.2 C36.1 C37.1 C38.1 C39.1 C40.1 C41.1 CLNA.2 CPA.2 CPA1.2 CPA2.2 CPLL.2 CRXMX.2 CTXMX.2 CVCCCP.2 CVCO0.2 CVCO1.2 CVCO2.2 CVRXA.2 CVRXF.2 CVXTAL.2 U2.5 U2.7 U2.12 U2.31 U2.32 U2.37 U2.42 U12.1 U12.2 U12.3 U12.4 U13.1 U13.2 U13.3 U13.4 U14.2 U14.26 U14.31 U14.47 U16.1 U16.2 U17.1 U17.2
VCC: C28.2 C30.1 C31.2 C32.2 C33.1 C36.2 C38.2 C39.2 C40.2 C41.2 U2.2 U2.8 U2.11 U2.18 U2.33 U2.39 U2.43 U2.46
3.3: CLNA.1 CPA.1 CPA1.1 CPA2.1 CPLL.1 CRXMX.1 CTXMX.1 CVCCCP.1 CVCO0.1 CVCO1.1 CVCO2.1 CVRXA.1 CVRXF.1 CVXTAL.1 U14.1 U14.7 U14.13 U14.17 U14.20 U14.25 U14.27 U14.30 U14.39 U14.41 U14.46
$1I35739/BBC_CLK: U2.6
$1I35739/BBC_DA0: U26.2
$1I35739/BBC_DA1: U25.2
$1I35739/BBC_DA2: U24.2
$1I35739/BBC_DA3: U23.2
$1I35739/BBC_DA4: U9.2
$1I35739/BBC_DA5: U8.2
$1I35739/BBC_DA6: U7.2
$1I35739/BBC_DA7: U19.2
$1I35739/BBC_DD0: U18.2
$1I35739/BBC_DD1: U6.2
$1I35739/BBC_DD2: U5.1
$1I35739/BBC_DD3: U15.1
$1I35739/BBC_DD4: U4.1
$1I35739/BBC_DD5: U3.1
$1I35739/BBC_DD6: U1.1
$1I35739/BBC_DD7: U11.1
$1I35739/BBC_IN: U2.44
$1I35739/BBC_IP: U2.45
$1I35739/BBC_QN: U2.40
$1I35739/BBC_QP: U2.41
$1I35739/CS#: U2.36
$1I35739/DIN: U2.34
$1I35739/RX_BBCIN: U2.4
$1I35739/RX_BBCIP: U2.3
$1I35739/RX_BBCQN: U2.9
$1I35739/RX_BBCQP: U2.10
$1I35739/SCLK: U2.35
BYPASS: C18.2 U14.33
CLKBUF: H12.1 U14.21
CPOUT: C20.2 U14.24 U21.2
CS#: U14.15
D1: U14.23
D2: U14.11
D3: U14.8
D4: U14.34
D5: U14.14
D6: U14.3
D7: U14.6
DIN: U14.19
PLL_LOCK: U14.22
PLLCLK: C19.1 H21.2
RSSI: U14.16
RXHP: U14.40
RXIN: U14.37
RXIP: U14.38
RXN: U14.5 U16.6
RXP: U14.4 U16.4
RXQN: U14.35
RXQP: U14.36
RXTX_MODE: U14.48
SCLK: U14.18
SHDN#: U14.12
TUNE: C22.2 U14.32 U20.1 U21.1
TXIN: U14.44
TXIP: U14.45
TXN: U14.10 U17.6
TXP: U14.9 U17.4
TXQN: U14.42
TXQP: U14.43
XTAL: C19.2 U14.28
$1I35739/$1N1453: C37.2 U2.47
$1I35739/$1N1456: U2.30 U11.2
$1I35739/$1N1459: U1.2 U2.29
$1I35739/$1N1462: U2.28 U3.2
$1I35739/$1N1465: U2.27 U4.2
$1I35739/$1N1468: U2.26 U15.2
$1I35739/$1N1471: U2.25 U5.2
$1I35739/$1N1476: U2.24 U6.1
$1I35739/$1N1479: U2.23 U18.1
$1I35739/$1N1484: U2.21 U7.1
$1I35739/$1N1487: U2.20 U8.1
$1I35739/$1N1490: U2.19 U9.1
$1I35739/$1N1493: U2.16 U23.1
$1I35739/$1N1496: U2.15 U24.1
$1I35739/$1N1499: U2.14 U25.1
$1I35739/$1N1502: U2.13 U26.1
$1I35739/$1N1504: C35.1 U2.48
$1I35739/$1N1505: C26.2 U2.1
$1I35739/$1N1514: U2.22 U19.1
$1N13355: U12.5 U16.3
$1N19235: H21.1
$1N20170: U13.5 U17.3
$1N20400: C21.2 U20.2

Pads without a net: U2 17 38 49; U14 29 49; U16 5; U17 5; U22 1 2 3 4 5 6 7 8 9 10 11 12 13 14 15 16 17 18 19 20 21 22 23 24 25 26 27 28 29 30 31 32 33 34 35 36 37 38 39 40

## Via types
v1: diameter 0.61, hole 0.305, Top Layer to Bottom Layer, 16 vias

## Routing (per net, layer and track width the routed paths; a pad name or vN(x,y) marks a point on that pad's centre or on a via; arc(x,y) is an arc through that point)
VCC: length 27
  Top Layer w0.33: U2.43 v1(8.8,8.04) ; v1(8.67,9.04) 9.21,9.58 9.65,9.58 U2.46 ; v1(3.72,8.03) 2.85,8.03 U2.18 ; v1(8.8,5.99) 8.84,6.04 U2.39 ; U2.33 v1(7.51,5.36) ; v1(9.31,2.44) C40.2
  Bottom Layer w0.33: 4.23,8.03 4.47,8.03 C41.2 ; 4.23,8.03 v1(3.72,8.03) ; 4.23,8.03 C39.2 ; C33.1 10.21,5.99 v1(8.8,5.99) ; v1(8.8,8.04) 10.2,8.04 10.43,7.81 ; 10.43,7.81 C28.2 ; 10.43,7.81 15.58,7.81 C36.2 15.66,7.9 ; v1(8.67,9.04) 11.35,9.04 C38.2 ; v1(9.31,2.44) 9.31,3.07 7.51,4.87 v1(7.51,5.36)
$1I35739/$1N1453: length 8.4
  Top Layer w0.33: v1(8.54,10.19) 8.65,10.19 8.8,10.04 U2.47
  Bottom Layer w0.33: C37.2 15.55,10.19 v1(8.54,10.19) ; 15.42,10.06 15.42,10.06 15.4,10.04
$1I35739/$1N1456: length 4.4
  Top Layer w0.33: U2.30 v1(6.01,5.36)
  Bottom Layer w0.33: v1(6.01,5.36) 6.01,3.56 U11.2
$1I35739/$1N1459: length 2.8
  Top Layer w0.33: U2.29 5.51,3.82 6.91,2.42 U1.2
$1I35739/$1N1462: length 3.9
  Top Layer w0.33: U2.28 v1(5.01,5.36)
  Bottom Layer w0.33: U3.2 5.01,2.44 v1(5.01,5.36)
$1I35739/$1N1465: length 2.1
  Top Layer w0.33: U2.27 4.51,2.9 U4.2
$1I35739/$1N1468: length 4.2
  Top Layer w0.33: U2.26 v1(4.01,5.23)
  Bottom Layer w0.33: U15.2 2.83,4.05 v1(4.01,5.23)
$1I35739/$1N1471: length 2.2
  Top Layer w0.33: U2.25 2.83,3.68 U5.2
$1I35739/$1N1476: length 2.4
  Top Layer w0.33: v1(2.19,4.09) 2.83,4.73 U2.24
  Bottom Layer w0.33: v1(2.19,4.09) 1.16,4.09 U6.1
$1I35739/$1N1479: length 2.3
  Top Layer w0.33: U18.1 2.36,5.54 U2.23
$1I35739/$1N1484: length 1.9
  Top Layer w0.33: U7.1 1.33,6.54 U2.21
$1I35739/$1N1487: length 4.3
  Top Layer w0.33: U2.20 v1(3.85,7.04)
  Bottom Layer w0.33: U8.1 2.28,7.04 v1(3.85,7.04)
$1I35739/$1N1490: length 2.1
  Top Layer w0.33: U9.1 1.56,8.3 2.32,7.54 U2.19
$1I35739/$1N1493: length 4.3
  Top Layer w0.33: U2.16 v1(3.85,9.04)
  Bottom Layer w0.33: v1(3.85,9.04) 2.15,9.04 U23.1
$1I35739/$1N1496: length 2.1
  Top Layer w0.33: U2.15 1.6,9.54 U24.1
$1I35739/$1N1499: length 4.8
  Top Layer w0.33: U2.14 v1(3.85,10.04)
  Bottom Layer w0.33: v1(3.85,10.04) 1.67,12.22 U25.1
$1I35739/$1N1502: length 2.5
  Top Layer w0.33: U2.13 1.15,12.22 U26.1
$1I35739/$1N1504: length 2.1
  Top Layer w0.33: v1(10.32,11.07) 10.22,11.07 U2.48
  Bottom Layer w0.33: v1(10.32,11.07) 11.35,11.07 C35.1 11.47,11.2
$1I35739/$1N1514: length 3.7
  Top Layer w0.33: U2.22 v1(3.72,6.04)
  Bottom Layer w0.33: U19.1 1.24,6.04 v1(3.72,6.04)
